# Altium schematic sheet Telemetry_MCU.SchDoc
size 420 x 297 mm; SheetNumber: 4; SheetTotal: 5
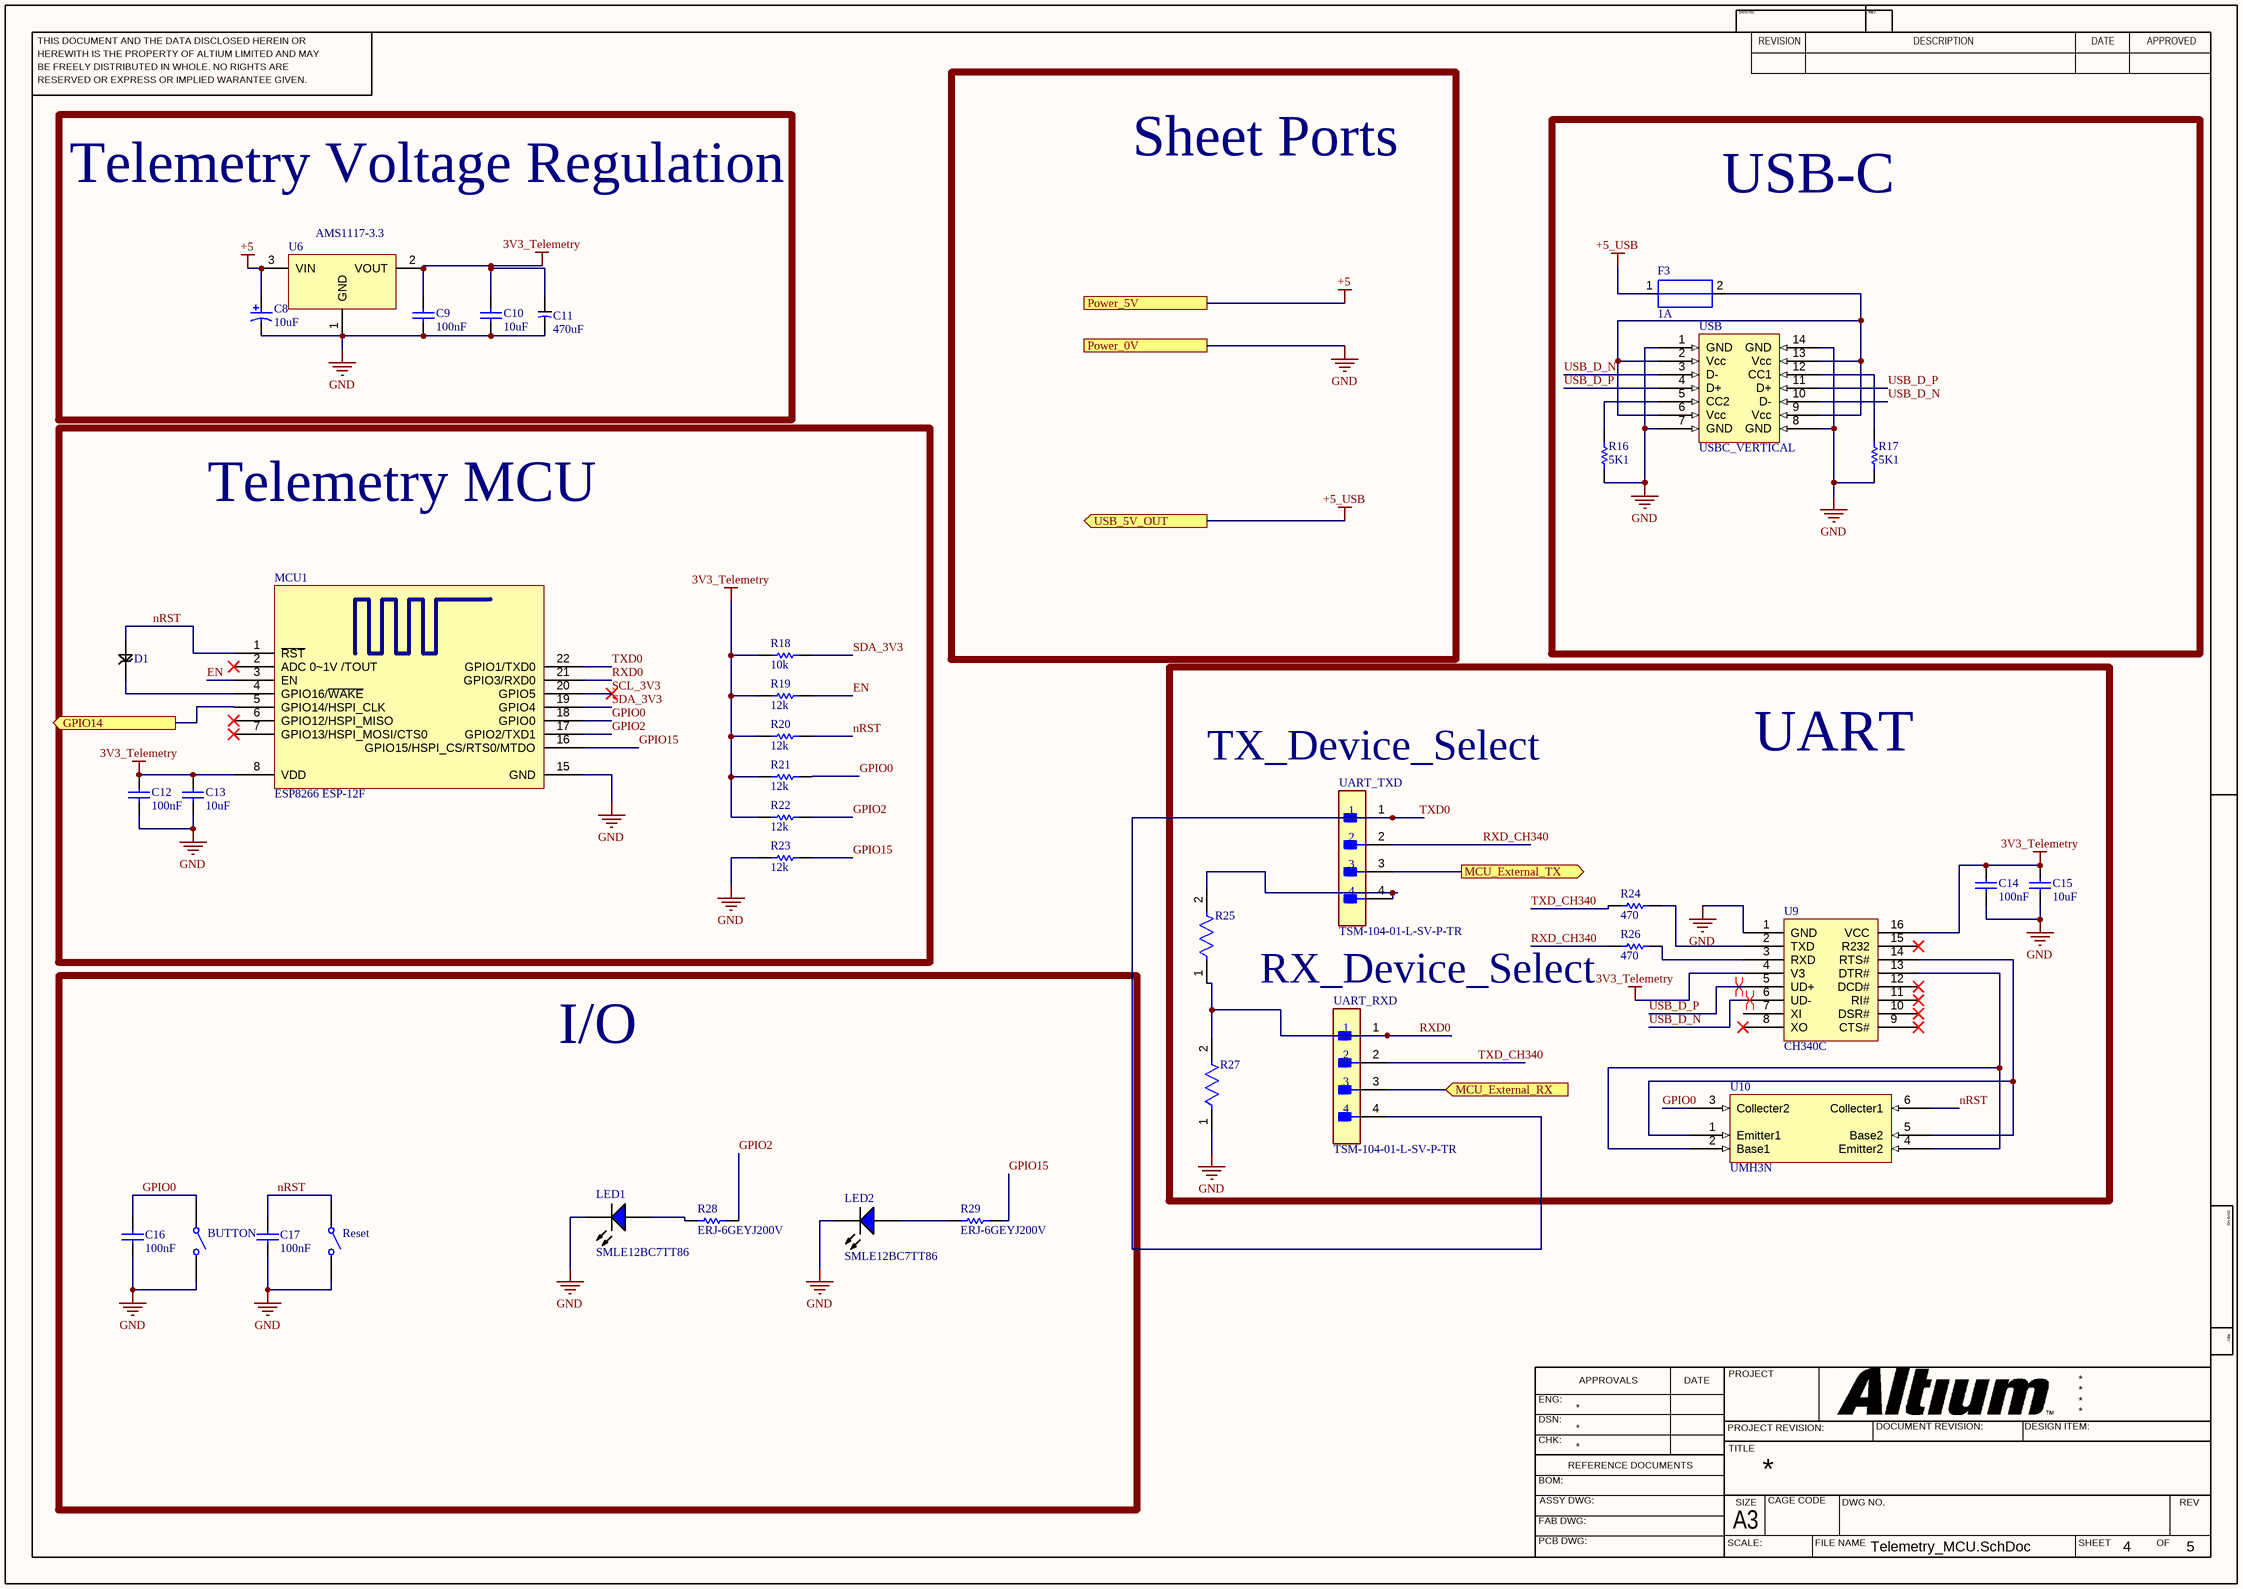
[diagram p0: Telemetry_MCU.SchDoc]

## Parts
BUTTON  434111050826  [434111050826]  (value not drawn)
C8  10uF  [KEMT-A-3216-18-2_M]
C9  100nF  [CAPC2013X88X50NL20T25]
C10  10uF  [CAPC2013X140X50NL20T25]
C11  470uF  [ULR477M1AE85RR]
C12  100nF  [CAPC2013X88X50NL20T25]
C13  10uF  [CAPC2013X140X50NL20T25]
C14  100nF  [CAPC2013X88X50NL20T25]
C15  10uF  [CAPC2013X140X50NL20T25]
C16  100nF  [CAPC2013X88X50NL20T25]
C17  100nF  [CAPC2013X88X50NL20T25]
D1  DFLS230L-7  [DFLS230L-7]  (value not drawn)
F3  1A  [0ZCG0050AF2C]
LED1  SMLE12BC7TT86  [ROHM-SMLE12BC7TT86_V]
LED2  SMLE12BC7TT86  [ROHM-SMLE12BC7TT86_V]
MCU1  ESP8266 ESP-12F  [ESP8266 ESP_12F - Danon NoSPI]
R16  5K1  [RESC2013X50X30NL20T20]
R17  5K1  [RESC2013X50X30NL20T20]
R18  10k  [RESC2013X60X40NL20T25_A]
R19  12k  [RESC2013X60X40NL20T25_A]
R20  12k  [RESC2013X60X40NL20T25_A]
R21  12k  [RESC2013X60X40NL20T25_A]
R22  12k  [RESC2013X60X40NL20T25_A]
R23  12k  [RESC2013X60X40NL20T25_A]
R24  470  [RESC2013X50X30NL20T20]
R25  CRCW080510K0FKEA  [FP-CRCW0805-e3-IPC_A]  (value not drawn)
R26  470  [RESC2013X50X30NL20T20]
R27  CRCW080510K0FKEA  [FP-CRCW0805-e3-IPC_A]  (value not drawn)
R28  ERJ-6GEYJ200V  [RESC2013X70X40LL20T20]
R29  ERJ-6GEYJ200V  [RESC2013X70X40LL20T20]
Reset  434111050826  [434111050826]  (value not drawn)
U6  AMS1117-3.3  [SOT-223]
U9  CH340C  [SOP16_50Mil_PinPitch]
U10  UMH3N  [UMH3N]
UART_RXD  TSM-104-01-L-SV-P-TR  [FP-TSM-104-01-L-SV-P-TR-MFG]
UART_TXD  TSM-104-01-L-SV-P-TR  [FP-TSM-104-01-L-SV-P-TR-MFG]
USB  USBC_VERTICAL  [USBC_Vertical]

## Blocks framed on the sheet
Telemetry Voltage Regulation: C8-C11 U6
USB-C: F3 R16 R17 USB
Telemetry MCU: C12 C13 D1 MCU1 R18-R23
UART: C14 C15 R24-R27 U9 U10 UART_RXD UART_TXD
I/O: BUTTON C16 C17 LED1 LED2 R28 R29 Reset

## Ports
GPIO14 (out), MCU_External_RX (in), MCU_External_TX (out), Power_0V, Power_5V, USB_5V_OUT (out)

## Nets
3V3_Telemetry: C9.2 C10.2 C11.2 C12.2 C13.2 C14.2 C15.2 MCU1.8(VDD) R18.1 R19.1 R20.1 R21.1 R22.1 U6.2(VOUT) U9.4(V3) U9.16(VCC)
+5: C8.1 U6.3(VIN) ; port Power_5V
+5_USB: F3.1(+) ; port USB_5V_OUT
GND: BUTTON.2 C8.2 C9.1 C10.1 C11.1 C12.1 C13.1 C14.1 C15.1 C16.1 C17.1 LED1.2(K) LED2.2(K) MCU1.15(GND) R16.1 R17.1 R23.1 R27.1 Reset.2 U6.1(GND) U9.1(GND) USB.1(GND) USB.7(GND) USB.8(GND) USB.14(GND) ; port Power_0V
EN: MCU1.3(EN) R19.2
GPIO0: BUTTON.1 C16.2 MCU1.18(GPIO0) R21.2 U10.3(Collecter2)
GPIO2: MCU1.17(GPIO2/TXD1) R22.2 R28.2
GPIO14: MCU1.5(GPIO14/HSPI_CLK) ; port GPIO14
GPIO15: MCU1.16(GPIO15/HSPI_CS/RTS0/MTDO) R23.2 R29.2
MCU_External_RX: UART_RXD.3 ; port MCU_External_RX
MCU_External_TX: UART_TXD.3 ; port MCU_External_TX
nRST: C17.2 D1.1 MCU1.1(~{RST}) R20.2 Reset.1 U10.6(Collecter1)
RXD0: MCU1.21(GPIO3/RXD0) R25.1 R27.2 UART_RXD.1
RXD_CH340: R26.1 UART_TXD.2
SCL_3V3: MCU1.20(GPIO5)
SDA_3V3: MCU1.19(GPIO4) R18.2
TXD0: MCU1.22(GPIO1/TXD0) UART_RXD.4 UART_TXD.1
TXD_CH340: R24.1 UART_RXD.2
USB_D_N: U9.6(UD-) USB.3(D-) USB.10(D-)
USB_D_P: U9.5(UD+) USB.4(D+) USB.11(D+)
NetD1_2: D1.2 MCU1.4(GPIO16/~{WAKE})
NetF3_2: F3.2(-) USB.2(Vcc) USB.6(Vcc) USB.9(Vcc) USB.13(Vcc)
NetLED1_1: LED1.1(A) R28.1
NetLED2_1: LED2.1(A) R29.1
NetR16_2: R16.2 USB.5(CC2)
NetR17_2: R17.2 USB.12(CC1)
NetR24_2: R24.2 U9.2(TXD)
NetR25_2: R25.2 UART_TXD.4
NetR26_2: R26.2 U9.3(RXD)
NetU9_13: U9.13(DTR#) U10.2(Base1) U10.4(Emitter2)
NetU9_14: U9.14(RTS#) U10.1(Emitter1) U10.5(Base2)

Not connected (* = marked no-connect by the designer): MCU1 2(ADC_0~1V_/TOUT)* 6(GPIO12/HSPI_MISO)* 7(GPIO13/HSPI_MOSI/CTS0)*; U9 7(XI) 8(XO)* 9(CTS#)* 10(DSR#)* 11(RI#)* 12(DCD#)* 15(R232)*

## Layout directives
differential pair: USB_D_N, USB_D_P

## Notes on the sheet
- Sheet Ports
- (near UART_TXD) TX_Device_Select
- (near R26) RX_Device_Select
- THIS DOCUMENT AND THE DATA DISCLOSED HEREIN OR
- HEREWITH IS THE PROPERTY OF ALTIUM LIMITED AND MAY
- DWG NO:
- REVISION
- REV:
- DESCRIPTION
- DATE
- APPROVED
- BE FREELY DISTRIBUTED IN WHOLE. NO RIGHTS ARE
- RESERVED OR EXPRESS OR IMPLIED WARANTEE GIVEN.
- ENG:
- APPROVALS
- PROJECT
- DSN:
- CHK:
- REFERENCE DOCUMENTS
- PROJECT REVISION:
- TITLE
- DOCUMENT REVISION:
- DESIGN ITEM:
- BOM:
- FAB DWG:
- PCB DWG:
- ASSY DWG:
- SCALE:
- A3
- SIZE
- CAGE CODE
- FILE NAME
- DWG NO.
- SHEET
- OF
- REV

## Library data of the parts
BUTTON Reset = CMP-1459-00003-1: WS-TASV SMD Tact Switch 6.0X3.5 mm; Manufacturer: Wuerth Elektronik; NoPins: 02; ComponentLink2URL: http://katalog.we-online.de/em/datasheet/434111050826.pdf; PackageReference: 434111050826; ComponentLink2Description: Datasheet; PartNumber: 434111050826; ComponentLink1URL: http://www.we-online.com; ComponentLink1Description: Manufacturer URL
C8 = CMP-2000-05172-1: Capacitor, Tantalum, 10 uF, +/- 10%, 10 V, -55 to 125 degC, 2-Pin SMD (1206), RoHS, Tape and Reel; Manufacturer Size Code: A; Manufacturer: Kemet; Type: Molded; Online Catalog: T491Series; Other Names: 399-3684-2; Voltage - Rated: 10V; Lifetime @ Temp.: 2000Hrs@85degC; Product Training Modules: CapacitorBasics-TypicalUsesforCapacitorsDeratingGuidelinesforSurfaceMountTantalumCapacitors; ESR (Equivalent Series Resistance): 3.8Ohm; Capacitance: 10µF; Catalog Drawings: T49x,T5xxSeries_A-side1T49x,T5xxSeries_A,B-side2T49x,T5xxSeries_A,SBottom; Family: TantalumCapacitors; Manufacturer URL: http://www.kemet.com/; Datasheet URL: http://www.farnell.com/datasheets/1824869.pdf; Package Reference: 1206; Packaging: Tape&Reel(TR); Series: T491; Operating Temperature: -55degC~125degC; Mounting Type: SurfaceMount; Height - Seated (Max): 0.071"(1.80mm); Package / Case: 1206(3216Metric); Package Description: 2-Pin Surface Mount Device, Body 3.2 x 1.6 mm; Features: GeneralPurpose; Tolerance: ±10%; Lead Spacing: -; Size / Dimension: 0.126"Lx0.063"W(3.20mmx1.60mm); Standard Package: 2,000; Datasheet Version: Apr-14; Category: Capacitors
C9 C12 C14 C16 C17 = CMP-2007-00279-1: Part Number: C0805C104K5RACTU; Manufacturer: Kemet
C10 C13 C15 = CMP-2007-03243-1: Part Number: C0805C106K8PACTU; Manufacturer: Kemet
C11 = ULR477M1AE85RR
F3 = 0ZCG0050AF2C: PTC Resettable Fuse 0.5A(hold) 1A(trip) 30VDC 100A 0.8W 0.15s 0.15Ohm SMD Solder Pad 1812 T/R; Manufacturer: Bel; Hold Current: 500mA; Supplier 1: Newark; Manufacturer Part Number: 0ZCG0050AF2C; RoHS: Yes; Category: PTC Resettable Fuses; Stock 1: 19101; Pricing 1: 1=0.14000, 10=0.12900, 25=0.12200, 50=0.11500, 100=0.10700, 250=0.09600 (USD); Mount: Surface Mount; Case/Package: 1812; Case Code (Metric): 4532; Case Code (Imperial): 1812; Contact Plating: Tin,Matte; Min Operating Temperature: -40°C; Max Operating Temperature: 85°C; Package Quantity: 1; Packaging: Tape and Reel; Max Current Rating: 100A; Trip Current: 1A; Time to Trip: 0.15s; Lead Free: Lead Free; RoHS Compliant: Yes; ComponentLink1URL: https://datasheet.ciiva.com/18550/0zcg-18550748.pdf?src-supplier=Digi-Key; ComponentLink1Description: https://datasheet.ciiva.com/18550/0zcg-18550748.pdf?src-supplier=Digi-Key; ComponentLink2URL: https://datasheet.ciiva.com/18550/0zcg-18550749.pdf?src-supplier=Digi-Key; ComponentLink2Description: https://datasheet.ciiva.com/18550/0zcg-18550749.pdf?src-supplier=Digi-Key; ComponentLink3URL: https://datasheet.ciiva.com/18550/0zcg-18550750.pdf?src-supplier=Digi-Key; ComponentLink3Description: https://datasheet.ciiva.com/18550/0zcg-18550750.pdf?src-supplier=Digi-Key; Supplier Part Number 1: 48AC8390
LED1 LED2 = CMP-2000-07118-1: Blue LED, 2.9 V, 20 mA, -30 to 85 degC, 2-Pin SMD, RoHS, Tape and Reel; Manufacturer: Rohm; Lens Type: Clear; Viewing Angle: 140°; Forward Voltage: 2.9V; Forward (Drive) Current: 20mA; Intensity: 22mcd; Datasheet Version: Rev. 2.0, 03/2010; Package Description: 2-Pin Surface Mount Device, Body 1.6 x 0.8 mm; Mounting Technology: SurfaceMount; Dimension: 1.6x0.8x0.36mm; Package Reference: 1608; Datasheet URL: https://datasheet.ciiva.com/11773/0900766b80df3ad8-11773825.pdf; Color: Blue; Manufacturer URL: http://www.rohm.com/web/global/
MCU1 = ESP8266 ESP-12F - Danon - NoSPI
R16 R17 = CMP-2001-04024-1: Manufacturer: Vishay Dale; Part Number: CRCW08055K10FKEA
R18-R23 = CMP-2000-06228-1: Metal Film Chip Resistor, High Reliability Type, 0.125 W, +/- 0.1%, -55 to 155 degC, 0805 (2012 Metric), RoHS, Tape and Reel; Voltage Rating: 100V; Power Rating: 125mW(1/8W); Brand: Panasonic; Temperature Coefficient: 25PPM/C; Resistance: 10kOhms; Product Category: ThinFilmResistors-SMD; Datasheet Version: 02/2016; Operating Temperature Range: -55Cto+155C; Length: 2mm; Mounting Technology: SurfaceMount; Manufacturer URL: http://www.panasonic.com/; Width: 1.25mm; Packaging: Reel; Product: ThinFilmResistorsSMD; Package / Case: 0805(2012metric); Termination Style: SMD/SMT; Tolerance: 0.1%; Datasheet URL: https://industrial.panasonic.com/cdbs/www-data/pdf/RDM0000/AOA0000C307.pdf; Package Description: 2-Pin Surface Mount Device, Body 2 x 1.25 mm; Factory Pack Quantity: 5000; Series: ERA-6A; Case Code - mm: 2012; RoHS: Details; Package Reference: 0805; Height: 0.5mm; Manufacturer: Panasonic; Case Code - in: 0805; Type: MetalFilmChipResistors
R24 R26 = CMP-2001-03930-1: Manufacturer: Vishay Dale; Part Number: CRCW0805470KFKEA
R25 R27 = CMP-2001-04908-2: RES Thick Film, 10kΩ, 1%, 0.125W, 100ppm/°C, 0805; Resistance: 10kR; Voltage Rating (DC): 150V; Power Rating: 125mW; Weight: 0.000194oz; Package Quantity: 5000; Military Standard: Not; Max Operating Temperature: 155°C; Temperature Coefficient: 100ppm/°C; Contact Plating: Tin; Width: 1.25mm; Height: 0.45mm; Radiation Hardening: No; Tolerance: 1%; Min Operating Temperature: -55°C; Voltage Rating: 150V; Length: 2mm; Depth: 1.25mm; Termination: SMD/SMT; Packaging: Tape and Reel; Case/Package: 0805; Case Code (Metric): 2012; Lead Free: Lead Free; Case Code (Imperial): 0805; Composition: Thick Film
R28 R29 = CMP-2001-00368-1: Manufacturer: Panasonic; Part Number: ERJ-6GEYJ200V
U6 = AMS1117-3.3: 3.3V  3-Terminal Adjustable Positive Voltage Regulator; ComponentLink1Description: Supplier URL; ComponentLink1URL: https://lcsc.com/product-detail/Low-Dropout-Regulators-LDO_AMS_AMS1117-3-3_AMS1117-3-3_C6186.html
UART_RXD UART_TXD = CMP-02766-000011-1: CONN HEADER SMD 4POS 2.54MM; Manufacturer: Samtec; Number Of Contacts: 4; Conn Gender: Male; Standoff Height: 0.04inch; Conn Orientation: Vertical; Current Rating: 5.4A; Voltage Rating: 475V; Manufacturer Part Number: TSM-104-01-L-SV-P-TR; Contact Material: Gold,Nickel; RoHS: TRUE; ComponentLink2URL: http://suddendocs.samtec.com/prints/tsm-1xx-xx-xxx-sv-xx-xxx-xx-mkt.pdf; Package: TSM-104-01-L-SV-P-TR; Lead Free: Yes; Automotive: No; Category: Conn; Digikey Description: CONN HEADER SMD 4POS 2.54MM; ComponentLink2Description: Datasheet; Temperature: -55°C to +125°C; Height: 0.403inch; Device Class L1: Connectors; Device Class L3: unset; Octopart: https://octopart.com/tsm-104-01-l-sv-p-tr-samtec-6805355; Pitch: 2.54mm; Footprint Url: http://suddendocs.samtec.com/prints/tsm-1xx-xx-xx-sv-xx-xxx-xx-footprint.pdf; Device Class L2: Headers and Wire Housings; Temperature Range Low: -55°C; Number Of Rows: 1; Temperature Range High: +125°C
U9 = CH340C: ComponentLink1Description: Supplier URL; ComponentLink1URL: https://lcsc.com/product-detail/USB_CH340C_C84681.html